# EasyEDA schematic Transistor.json
TITLE: Sheet_1; REV: 1.0; Date: 2024-07-22; Sheet: 1/1; Drawn By: apoorva_5036; Company: Your Company
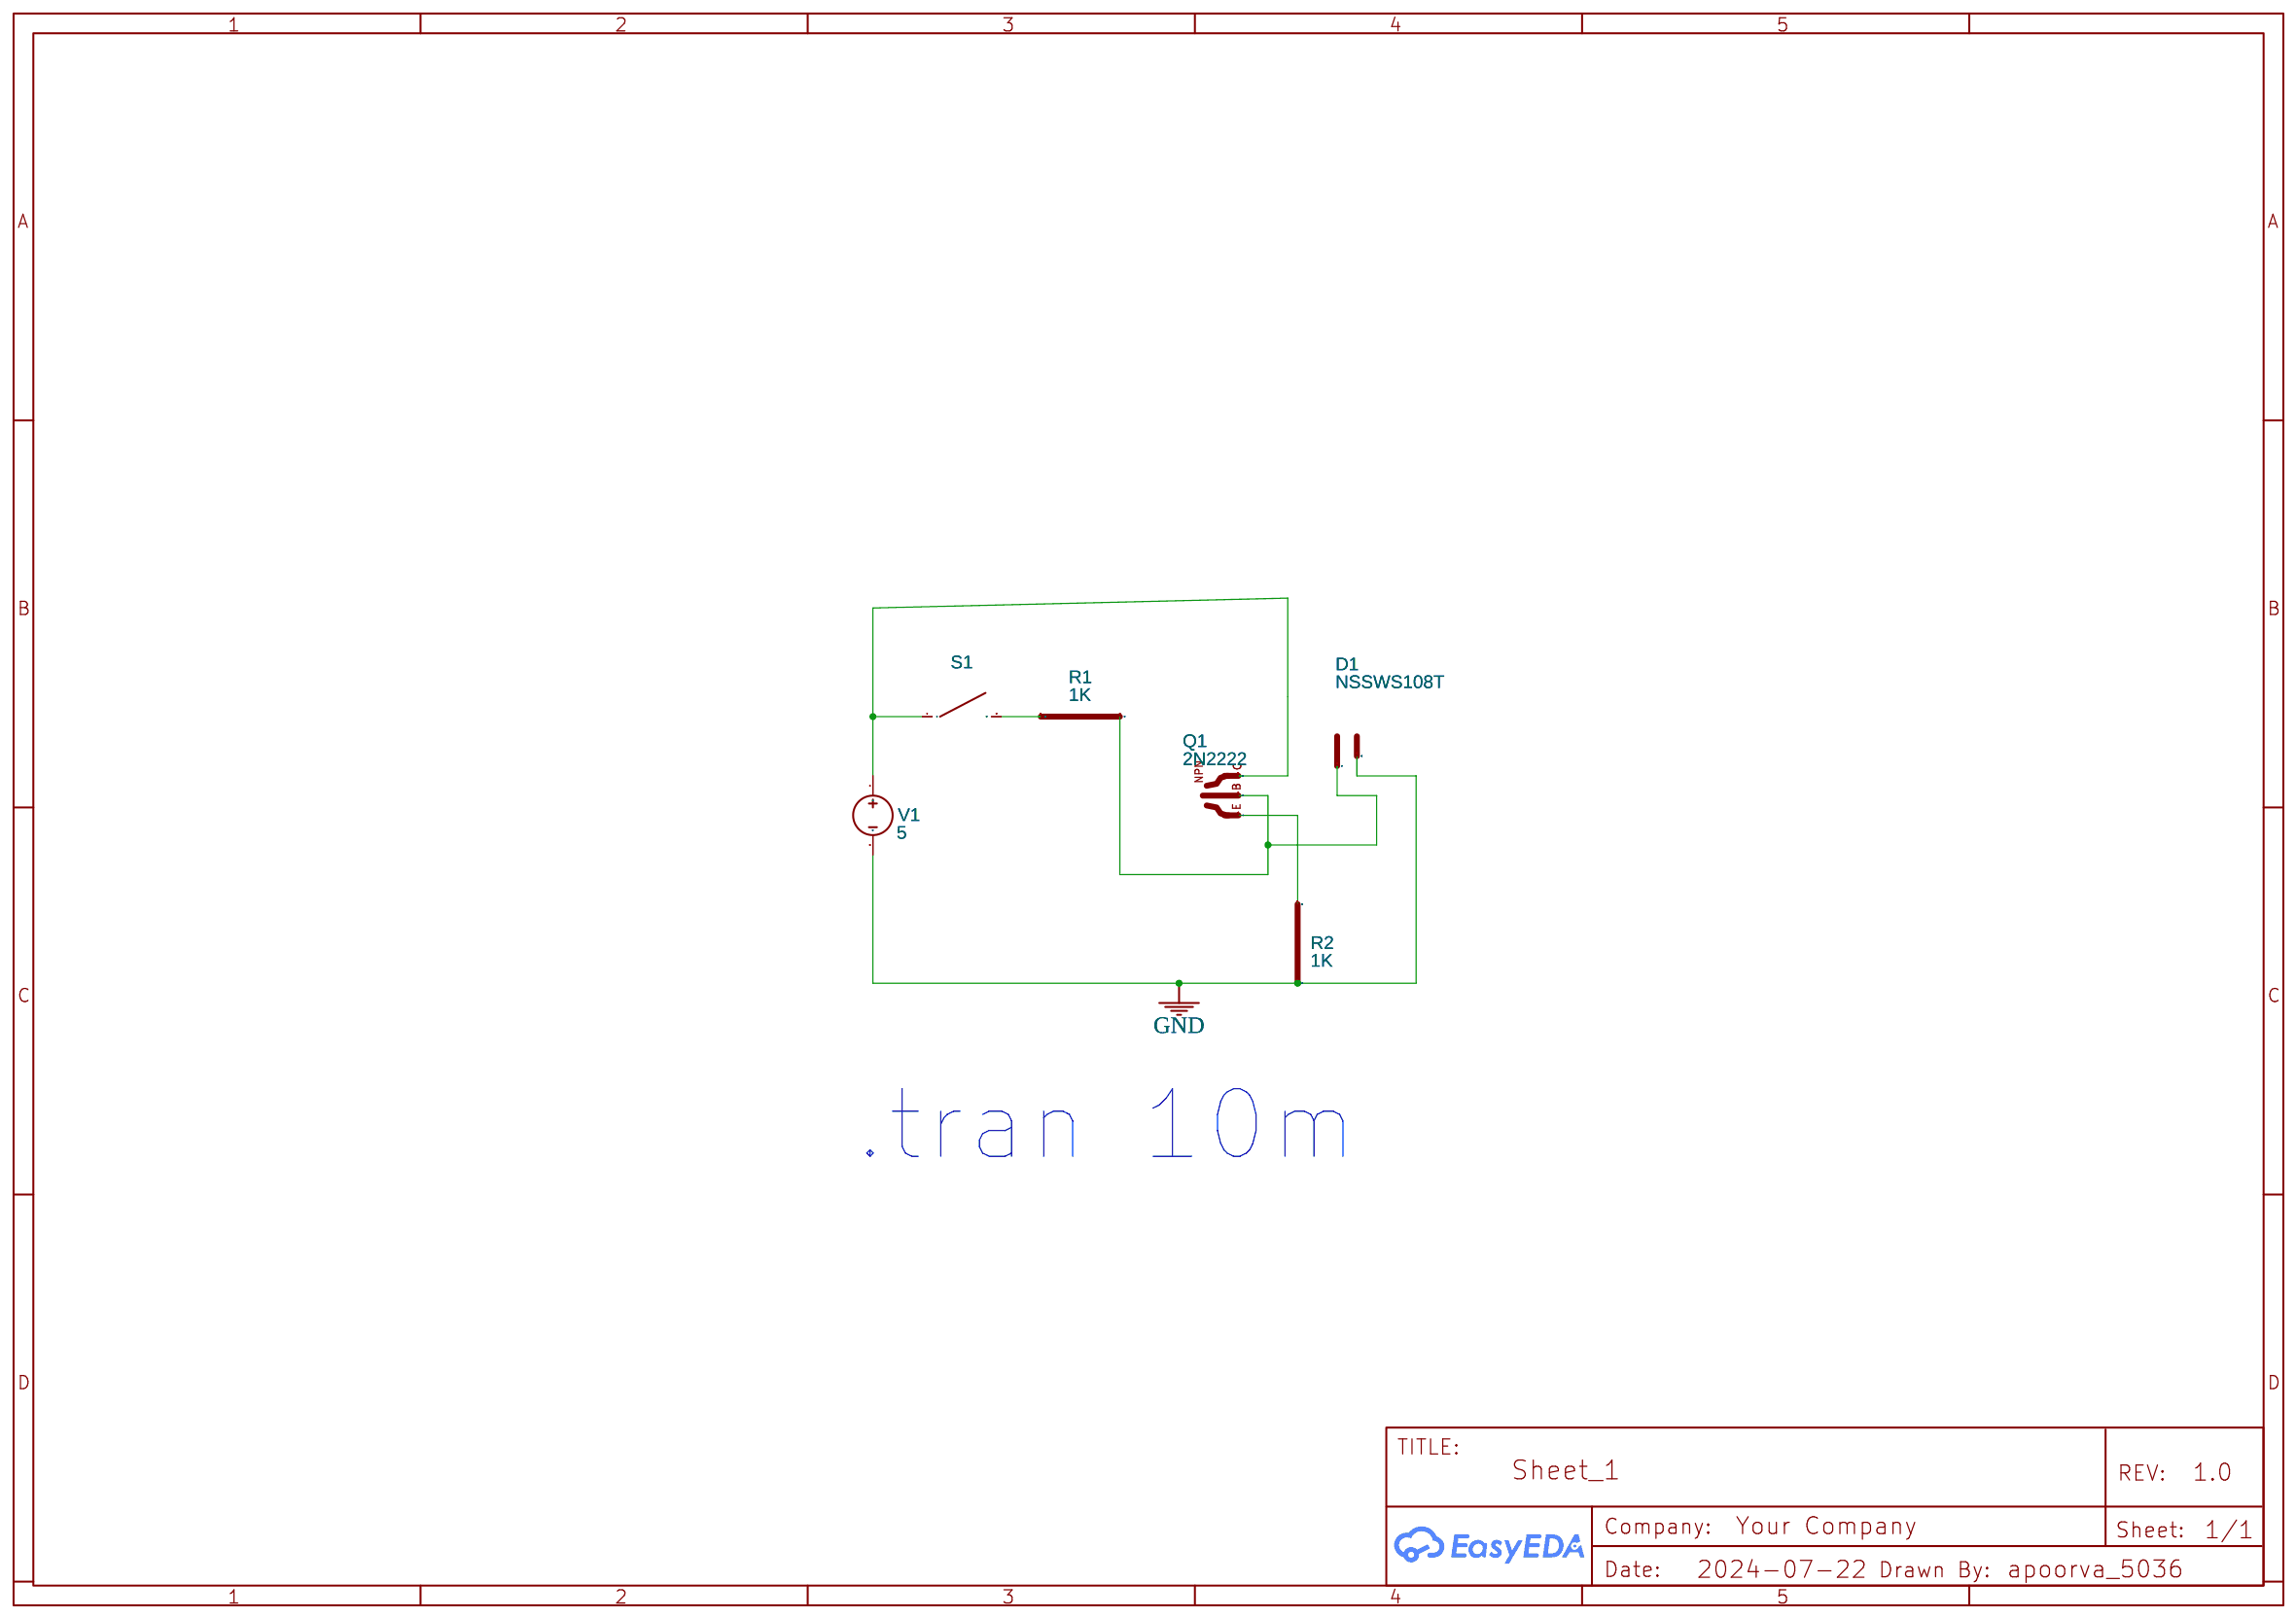
[diagram p0: schematic sheet]

## Parts
D1  NSSWS108T
Q1  2N2222
R1  1K  [AXIAL-0.3]
R2  1K  [AXIAL-0.3]
S1  SPST_Open
V1  5  [HDR1X2]

## Library data of the parts
D1 = NSSWS108T: catid: 20; Contributor: EasyEDA
Q1 = 2N2222: catid: 20; Contributor: EasyEDA
R1 R2 = Resistor_3D: catid: 20; Contributor: EasyEDA; Resistance: 1k
S1 = SPST: catid: 20; State: Open; Contributor: EasyEDA; NameDisplay: 0
V1 = VDC: Contributor: EasyEDA; sim: true

## Nets
GND: D1.2  R2.1 V1.2
Net-(D1-1): D1.1 Q1.2 (B) R1.2
Net-(Q1-1 ): Q1.1 (E) R2.2
Net-(Q1-3 ): Q1.3 (C) S1.1 V1.1
Net-(R1-1): R1.1 S1.2

## Notes on the sheet
- .tran 10m
